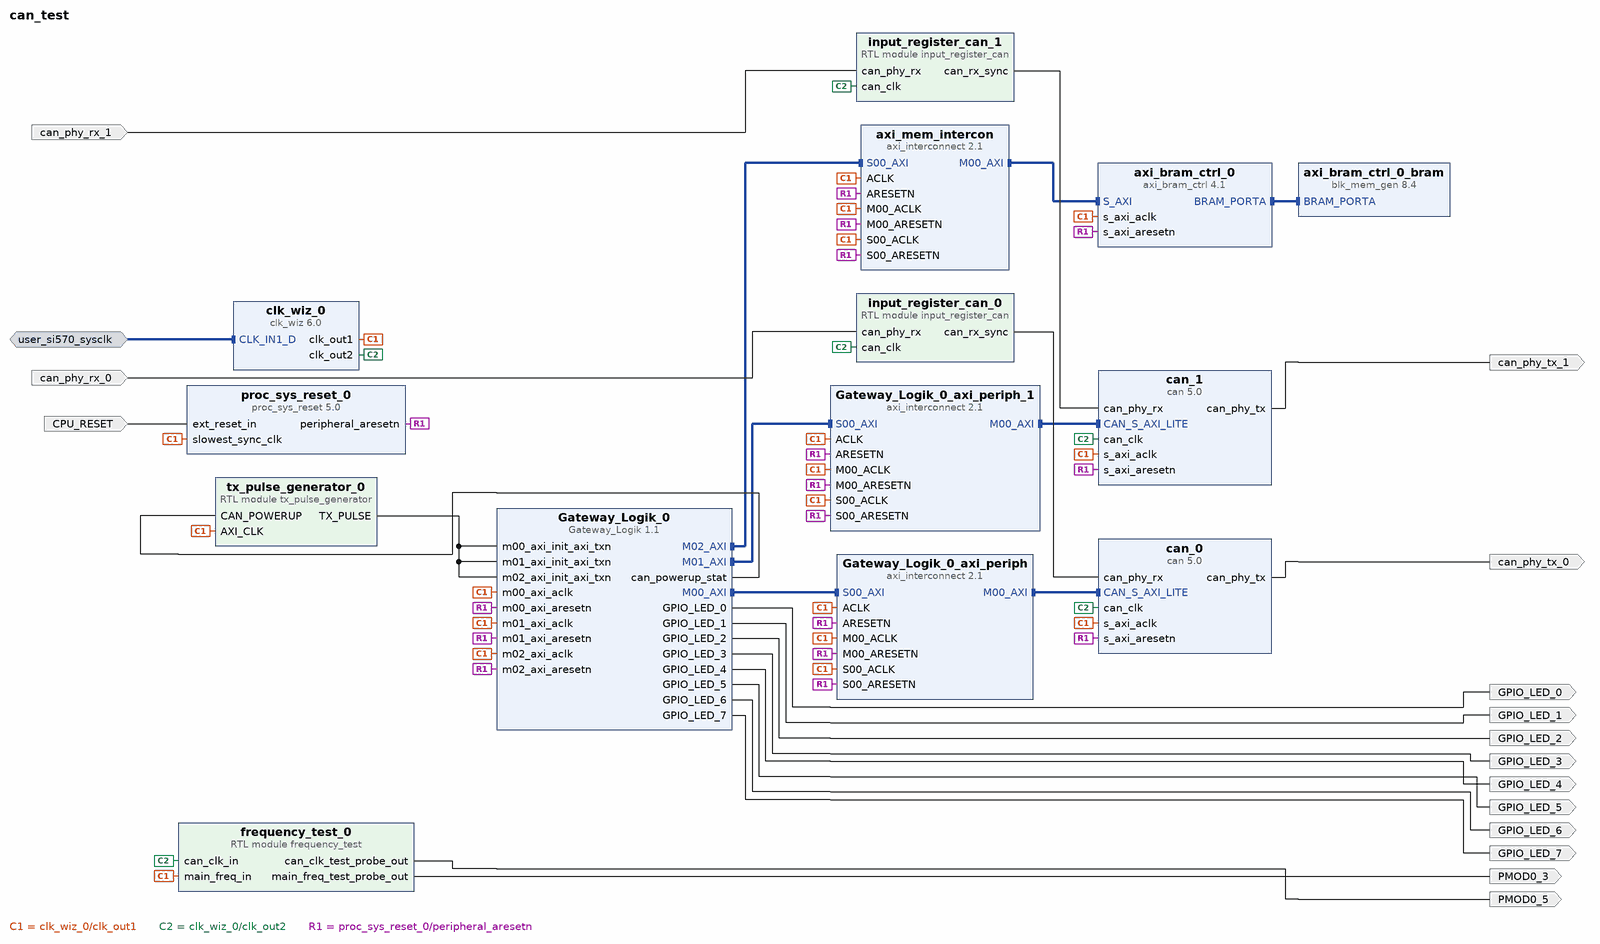
[diagram p0: block diagram of the top level]
# Vivado block design can_test, xczu9eg-ffvb1156-2-e, Vivado 2022.2.2
create_bd_design can_test

create_bd_intf_port -mode Slave -vlnv xilinx.com:interface:diff_clock_rtl:1.0 user_si570_sysclk
set_property -dict {CONFIG.FREQ_HZ 300000000} [get_bd_intf_ports user_si570_sysclk]
create_bd_port -dir I -type rst CPU_RESET
set_property -dict {CONFIG.POLARITY ACTIVE_HIGH} [get_bd_ports CPU_RESET]
create_bd_port -dir O PMOD0_3
create_bd_port -dir O PMOD0_5
create_bd_port -dir O GPIO_LED_0
create_bd_port -dir O GPIO_LED_2
create_bd_port -dir O GPIO_LED_3
create_bd_port -dir O GPIO_LED_4
create_bd_port -dir O GPIO_LED_6
create_bd_port -dir O GPIO_LED_7
create_bd_port -dir O GPIO_LED_1
create_bd_port -dir I can_phy_rx_0
create_bd_port -dir I can_phy_rx_1
create_bd_port -dir O can_phy_tx_0
create_bd_port -dir O can_phy_tx_1
create_bd_port -dir O GPIO_LED_5

create_bd_cell -type ip -vlnv xilinx.com:ip:can:5.0 can_0
set_property -dict {CONFIG.Cs_Mtbf_Stages 4 CONFIG.Rx_Fifo_Depth 64 CONFIG.Tx_Fifo_Depth 64} [get_bd_cells can_0]
create_bd_cell -type ip -vlnv xilinx.com:ip:proc_sys_reset:5.0 proc_sys_reset_0
set_property -dict {CONFIG.RESET_BOARD_INTERFACE Custom} [get_bd_cells proc_sys_reset_0]
create_bd_cell -type module -reference input_register_can input_register_can_0
create_bd_cell -type module -reference frequency_test frequency_test_0
create_bd_cell -type ip -vlnv xilinx.com:ip:clk_wiz:6.0 clk_wiz_0
set_property -dict [list \
  CONFIG.CLKOUT2_JITTER 134.928 \
  CONFIG.CLKOUT2_PHASE_ERROR 77.836 \
  CONFIG.CLKOUT2_REQUESTED_OUT_FREQ 24 \
  CONFIG.CLKOUT2_USED true \
  CONFIG.CLK_IN1_BOARD_INTERFACE user_si570_sysclk \
  CONFIG.MMCM_CLKOUT1_DIVIDE 50 \
  CONFIG.NUM_OUT_CLKS 2 \
  CONFIG.OPTIMIZE_CLOCKING_STRUCTURE_EN true \
  CONFIG.RESET_PORT resetn \
  CONFIG.RESET_TYPE ACTIVE_LOW \
  CONFIG.USE_BOARD_FLOW true \
  CONFIG.USE_LOCKED false \
  CONFIG.USE_RESET false \
] [get_bd_cells clk_wiz_0]
create_bd_cell -type ip -vlnv xilinx.com:ip:can:5.0 can_1
set_property -dict {CONFIG.Cs_Mtbf_Stages 4 CONFIG.Rx_Fifo_Depth 64 CONFIG.Tx_Fifo_Depth 64} [get_bd_cells can_1]
create_bd_cell -type ip -vlnv xilinx.com:ip:axi_bram_ctrl:4.1 axi_bram_ctrl_0
set_property -dict {CONFIG.PROTOCOL AXI4LITE CONFIG.SINGLE_PORT_BRAM 1} [get_bd_cells axi_bram_ctrl_0]
create_bd_cell -type ip -vlnv xilinx.com:ip:blk_mem_gen:8.4 axi_bram_ctrl_0_bram
create_bd_cell -type module -reference input_register_can input_register_can_1
create_bd_cell -type ip -vlnv xilinx.com:ip:axi_interconnect:2.1 axi_mem_intercon
set_property -dict {CONFIG.NUM_MI 1} [get_bd_cells axi_mem_intercon]
create_bd_cell -type ip -vlnv xilinx.com:ip:axi_interconnect:2.1 Gateway_Logik_0_axi_periph
set_property -dict [list \
  CONFIG.ENABLE_ADVANCED_OPTIONS 1 \
  CONFIG.NUM_MI 1 \
  CONFIG.XBAR_DATA_WIDTH 128 \
] [get_bd_cells Gateway_Logik_0_axi_periph]
create_bd_cell -type ip -vlnv xilinx.com:ip:axi_interconnect:2.1 Gateway_Logik_0_axi_periph_1
set_property -dict [list \
  CONFIG.ENABLE_ADVANCED_OPTIONS 1 \
  CONFIG.NUM_MI 1 \
  CONFIG.XBAR_DATA_WIDTH 128 \
] [get_bd_cells Gateway_Logik_0_axi_periph_1]
create_bd_cell -type module -reference tx_pulse_generator tx_pulse_generator_0
create_bd_cell -type ip -vlnv user.org:user:Gateway_Logik:1.1 Gateway_Logik_0
set_property -dict [list \
  CONFIG.C_M00_AXI_START_DATA_VALUE 0x00000000 \
  CONFIG.C_M00_AXI_TARGET_SLAVE_BASE_ADDR 0x00000000 \
  CONFIG.C_M00_AXI_TRANSACTIONS_NUM 6 \
  CONFIG.C_M01_AXI_START_DATA_VALUE 0x00000000 \
  CONFIG.C_M01_AXI_TARGET_SLAVE_BASE_ADDR 0x00000000 \
  CONFIG.C_M01_AXI_TRANSACTIONS_NUM 6 \
  CONFIG.C_M02_AXI_START_DATA_VALUE 0x00000000 \
  CONFIG.C_M02_AXI_TARGET_SLAVE_BASE_ADDR 0x00000000 \
  CONFIG.C_M02_AXI_TRANSACTIONS_NUM 5 \
] [get_bd_cells Gateway_Logik_0]

# ---- connections ----

connect_bd_intf_net [get_bd_intf_pins Gateway_Logik_0/M00_AXI] [get_bd_intf_pins Gateway_Logik_0_axi_periph/S00_AXI]
connect_bd_intf_net [get_bd_intf_pins Gateway_Logik_0/M01_AXI] [get_bd_intf_pins Gateway_Logik_0_axi_periph_1/S00_AXI]
connect_bd_intf_net [get_bd_intf_pins Gateway_Logik_0/M02_AXI] [get_bd_intf_pins axi_mem_intercon/S00_AXI]
connect_bd_intf_net [get_bd_intf_pins Gateway_Logik_0_axi_periph_1/M00_AXI] [get_bd_intf_pins can_1/CAN_S_AXI_LITE]
connect_bd_intf_net [get_bd_intf_pins Gateway_Logik_0_axi_periph/M00_AXI] [get_bd_intf_pins can_0/CAN_S_AXI_LITE]
connect_bd_intf_net [get_bd_intf_pins axi_bram_ctrl_0_bram/BRAM_PORTA] [get_bd_intf_pins axi_bram_ctrl_0/BRAM_PORTA]
connect_bd_intf_net [get_bd_intf_pins axi_mem_intercon/M00_AXI] [get_bd_intf_pins axi_bram_ctrl_0/S_AXI]
connect_bd_intf_net [get_bd_intf_ports user_si570_sysclk] [get_bd_intf_pins clk_wiz_0/CLK_IN1_D]
connect_bd_net [get_bd_ports CPU_RESET] [get_bd_pins proc_sys_reset_0/ext_reset_in]
connect_bd_net [get_bd_pins Gateway_Logik_0/GPIO_LED_0] [get_bd_ports GPIO_LED_0]
connect_bd_net [get_bd_pins Gateway_Logik_0/GPIO_LED_1] [get_bd_ports GPIO_LED_1]
connect_bd_net [get_bd_pins Gateway_Logik_0/GPIO_LED_2] [get_bd_ports GPIO_LED_2]
connect_bd_net [get_bd_pins Gateway_Logik_0/GPIO_LED_3] [get_bd_ports GPIO_LED_3]
connect_bd_net [get_bd_pins Gateway_Logik_0/GPIO_LED_4] [get_bd_ports GPIO_LED_4]
connect_bd_net [get_bd_pins Gateway_Logik_0/GPIO_LED_5] [get_bd_ports GPIO_LED_5]
connect_bd_net [get_bd_pins Gateway_Logik_0/GPIO_LED_6] [get_bd_ports GPIO_LED_6]
connect_bd_net [get_bd_pins Gateway_Logik_0/GPIO_LED_7] [get_bd_ports GPIO_LED_7]
connect_bd_net [get_bd_pins Gateway_Logik_0/can_powerup_stat] [get_bd_pins tx_pulse_generator_0/CAN_POWERUP]
connect_bd_net [get_bd_pins can_0/can_phy_tx] [get_bd_ports can_phy_tx_0]
connect_bd_net [get_bd_pins can_1/can_phy_tx] [get_bd_ports can_phy_tx_1]
connect_bd_net -net can_phy_rx_0_1 [get_bd_ports can_phy_rx_0] [get_bd_pins input_register_can_0/can_phy_rx]
connect_bd_net -net can_phy_rx_1_1 [get_bd_ports can_phy_rx_1] [get_bd_pins input_register_can_1/can_phy_rx]
connect_bd_net [get_bd_pins clk_wiz_0/clk_out1] \
  [get_bd_pins can_0/s_axi_aclk] [get_bd_pins proc_sys_reset_0/slowest_sync_clk] [get_bd_pins frequency_test_0/main_freq_in] \
  [get_bd_pins axi_bram_ctrl_0/s_axi_aclk] [get_bd_pins can_1/s_axi_aclk] [get_bd_pins axi_mem_intercon/ACLK] \
  [get_bd_pins axi_mem_intercon/S00_ACLK] [get_bd_pins axi_mem_intercon/M00_ACLK] \
  [get_bd_pins Gateway_Logik_0_axi_periph/ACLK] [get_bd_pins Gateway_Logik_0_axi_periph/S00_ACLK] \
  [get_bd_pins Gateway_Logik_0_axi_periph/M00_ACLK] [get_bd_pins Gateway_Logik_0_axi_periph_1/ACLK] \
  [get_bd_pins Gateway_Logik_0_axi_periph_1/S00_ACLK] [get_bd_pins Gateway_Logik_0_axi_periph_1/M00_ACLK] \
  [get_bd_pins tx_pulse_generator_0/AXI_CLK] [get_bd_pins Gateway_Logik_0/m00_axi_aclk] \
  [get_bd_pins Gateway_Logik_0/m01_axi_aclk] [get_bd_pins Gateway_Logik_0/m02_axi_aclk]
connect_bd_net [get_bd_pins clk_wiz_0/clk_out2] \
  [get_bd_pins can_0/can_clk] [get_bd_pins input_register_can_0/can_clk] [get_bd_pins frequency_test_0/can_clk_in] \
  [get_bd_pins can_1/can_clk] [get_bd_pins input_register_can_1/can_clk]
connect_bd_net [get_bd_pins frequency_test_0/can_clk_test_probe_out] [get_bd_ports PMOD0_5]
connect_bd_net [get_bd_pins frequency_test_0/main_freq_test_probe_out] [get_bd_ports PMOD0_3]
connect_bd_net [get_bd_pins input_register_can_0/can_rx_sync] [get_bd_pins can_0/can_phy_rx]
connect_bd_net [get_bd_pins input_register_can_1/can_rx_sync] [get_bd_pins can_1/can_phy_rx]
connect_bd_net [get_bd_pins proc_sys_reset_0/peripheral_aresetn] \
  [get_bd_pins can_0/s_axi_aresetn] [get_bd_pins axi_bram_ctrl_0/s_axi_aresetn] [get_bd_pins can_1/s_axi_aresetn] \
  [get_bd_pins axi_mem_intercon/S00_ARESETN] [get_bd_pins axi_mem_intercon/M00_ARESETN] \
  [get_bd_pins axi_mem_intercon/ARESETN] [get_bd_pins Gateway_Logik_0_axi_periph/S00_ARESETN] \
  [get_bd_pins Gateway_Logik_0_axi_periph/M00_ARESETN] [get_bd_pins Gateway_Logik_0_axi_periph/ARESETN] \
  [get_bd_pins Gateway_Logik_0_axi_periph_1/S00_ARESETN] [get_bd_pins Gateway_Logik_0_axi_periph_1/M00_ARESETN] \
  [get_bd_pins Gateway_Logik_0_axi_periph_1/ARESETN] [get_bd_pins Gateway_Logik_0/m00_axi_aresetn] \
  [get_bd_pins Gateway_Logik_0/m01_axi_aresetn] [get_bd_pins Gateway_Logik_0/m02_axi_aresetn]
connect_bd_net [get_bd_pins tx_pulse_generator_0/TX_PULSE] \
  [get_bd_pins Gateway_Logik_0/m00_axi_init_axi_txn] [get_bd_pins Gateway_Logik_0/m01_axi_init_axi_txn] \
  [get_bd_pins Gateway_Logik_0/m02_axi_init_axi_txn]

# ---- address map ----
assign_bd_address -offset 0x44A10000 -range 64K -target_address_space [get_bd_addr_spaces Gateway_Logik_0/M00_AXI] [get_bd_addr_segs can_0/CAN_S_AXI_LITE/Reg]
assign_bd_address -offset 0x44A00000 -range 64K -target_address_space [get_bd_addr_spaces Gateway_Logik_0/M01_AXI] [get_bd_addr_segs can_1/CAN_S_AXI_LITE/Reg]
assign_bd_address -offset 0xC0000000 -range 8K -target_address_space [get_bd_addr_spaces Gateway_Logik_0/M02_AXI] [get_bd_addr_segs axi_bram_ctrl_0/S_AXI/Mem0]

validate_bd_design
save_bd_design
